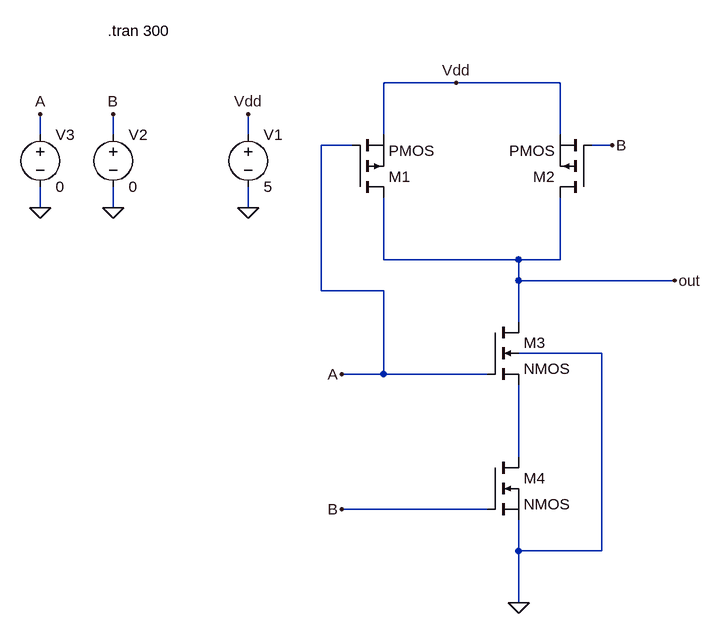
[diagram p0: schematic Draft1.asc]
Draft1.asc, the LTspice schematic file:
Version 4
SHEET 1 880 880
WIRE 320 64 208 64
WIRE 480 64 320 64
WIRE -320 144 -320 112
WIRE -208 144 -208 112
WIRE 0 144 0 112
WIRE 208 144 208 64
WIRE 480 144 480 64
WIRE 160 160 112 160
WIRE 560 160 528 160
WIRE -320 256 -320 224
WIRE -208 256 -208 224
WIRE 0 256 0 224
WIRE 208 336 208 240
WIRE 416 336 208 336
WIRE 480 336 480 240
WIRE 480 336 416 336
WIRE 416 368 416 336
WIRE 656 368 416 368
WIRE 112 384 112 160
WIRE 208 384 112 384
WIRE 416 432 416 368
WIRE 544 480 416 480
WIRE 208 512 208 384
WIRE 208 512 144 512
WIRE 368 512 208 512
WIRE 416 640 416 528
WIRE 368 720 144 720
WIRE 416 784 416 736
WIRE 544 784 544 480
WIRE 544 784 416 784
WIRE 416 864 416 784
FLAG 144 512 A
FLAG 144 720 B
FLAG 656 368 out
FLAG 416 864 0
FLAG 0 256 0
FLAG 0 112 Vdd
FLAG -208 256 0
FLAG -208 112 B
FLAG -320 256 0
FLAG -320 112 A
FLAG 320 64 Vdd
FLAG 560 160 B
SYMBOL nmos 368 640 R0
SYMATTR InstName M4
SYMBOL voltage 0 128 R0
SYMATTR InstName V1
SYMATTR Value 5
SYMBOL voltage -208 128 R0
SYMATTR InstName V2
SYMATTR Value 0
SYMBOL voltage -320 128 R0
SYMATTR InstName V3
SYMATTR Value 0
SYMBOL pmos 160 240 M180
SYMATTR InstName M1
SYMBOL pmos 528 240 R180
SYMATTR InstName M2
SYMBOL nmos4 368 432 R0
SYMATTR InstName M3
TEXT -216 -16 Left 2 !.tran 300

The netlist it stands for:
* Draft1.asc
M4 N001 B 0 0 NMOS
V1 Vdd 0 5
V2 B 0 0
V3 A 0 0
M1 out A Vdd Vdd PMOS
M2 out B Vdd Vdd PMOS
M3 out A N001 0 NMOS
.model NMOS NMOS
.model PMOS PMOS
.lib standard.mos
.tran 300
.backanno
.end